# Altium schematic sheet POWER.SchDoc
size A3; SheetNumber: 5; SheetTotal: 13
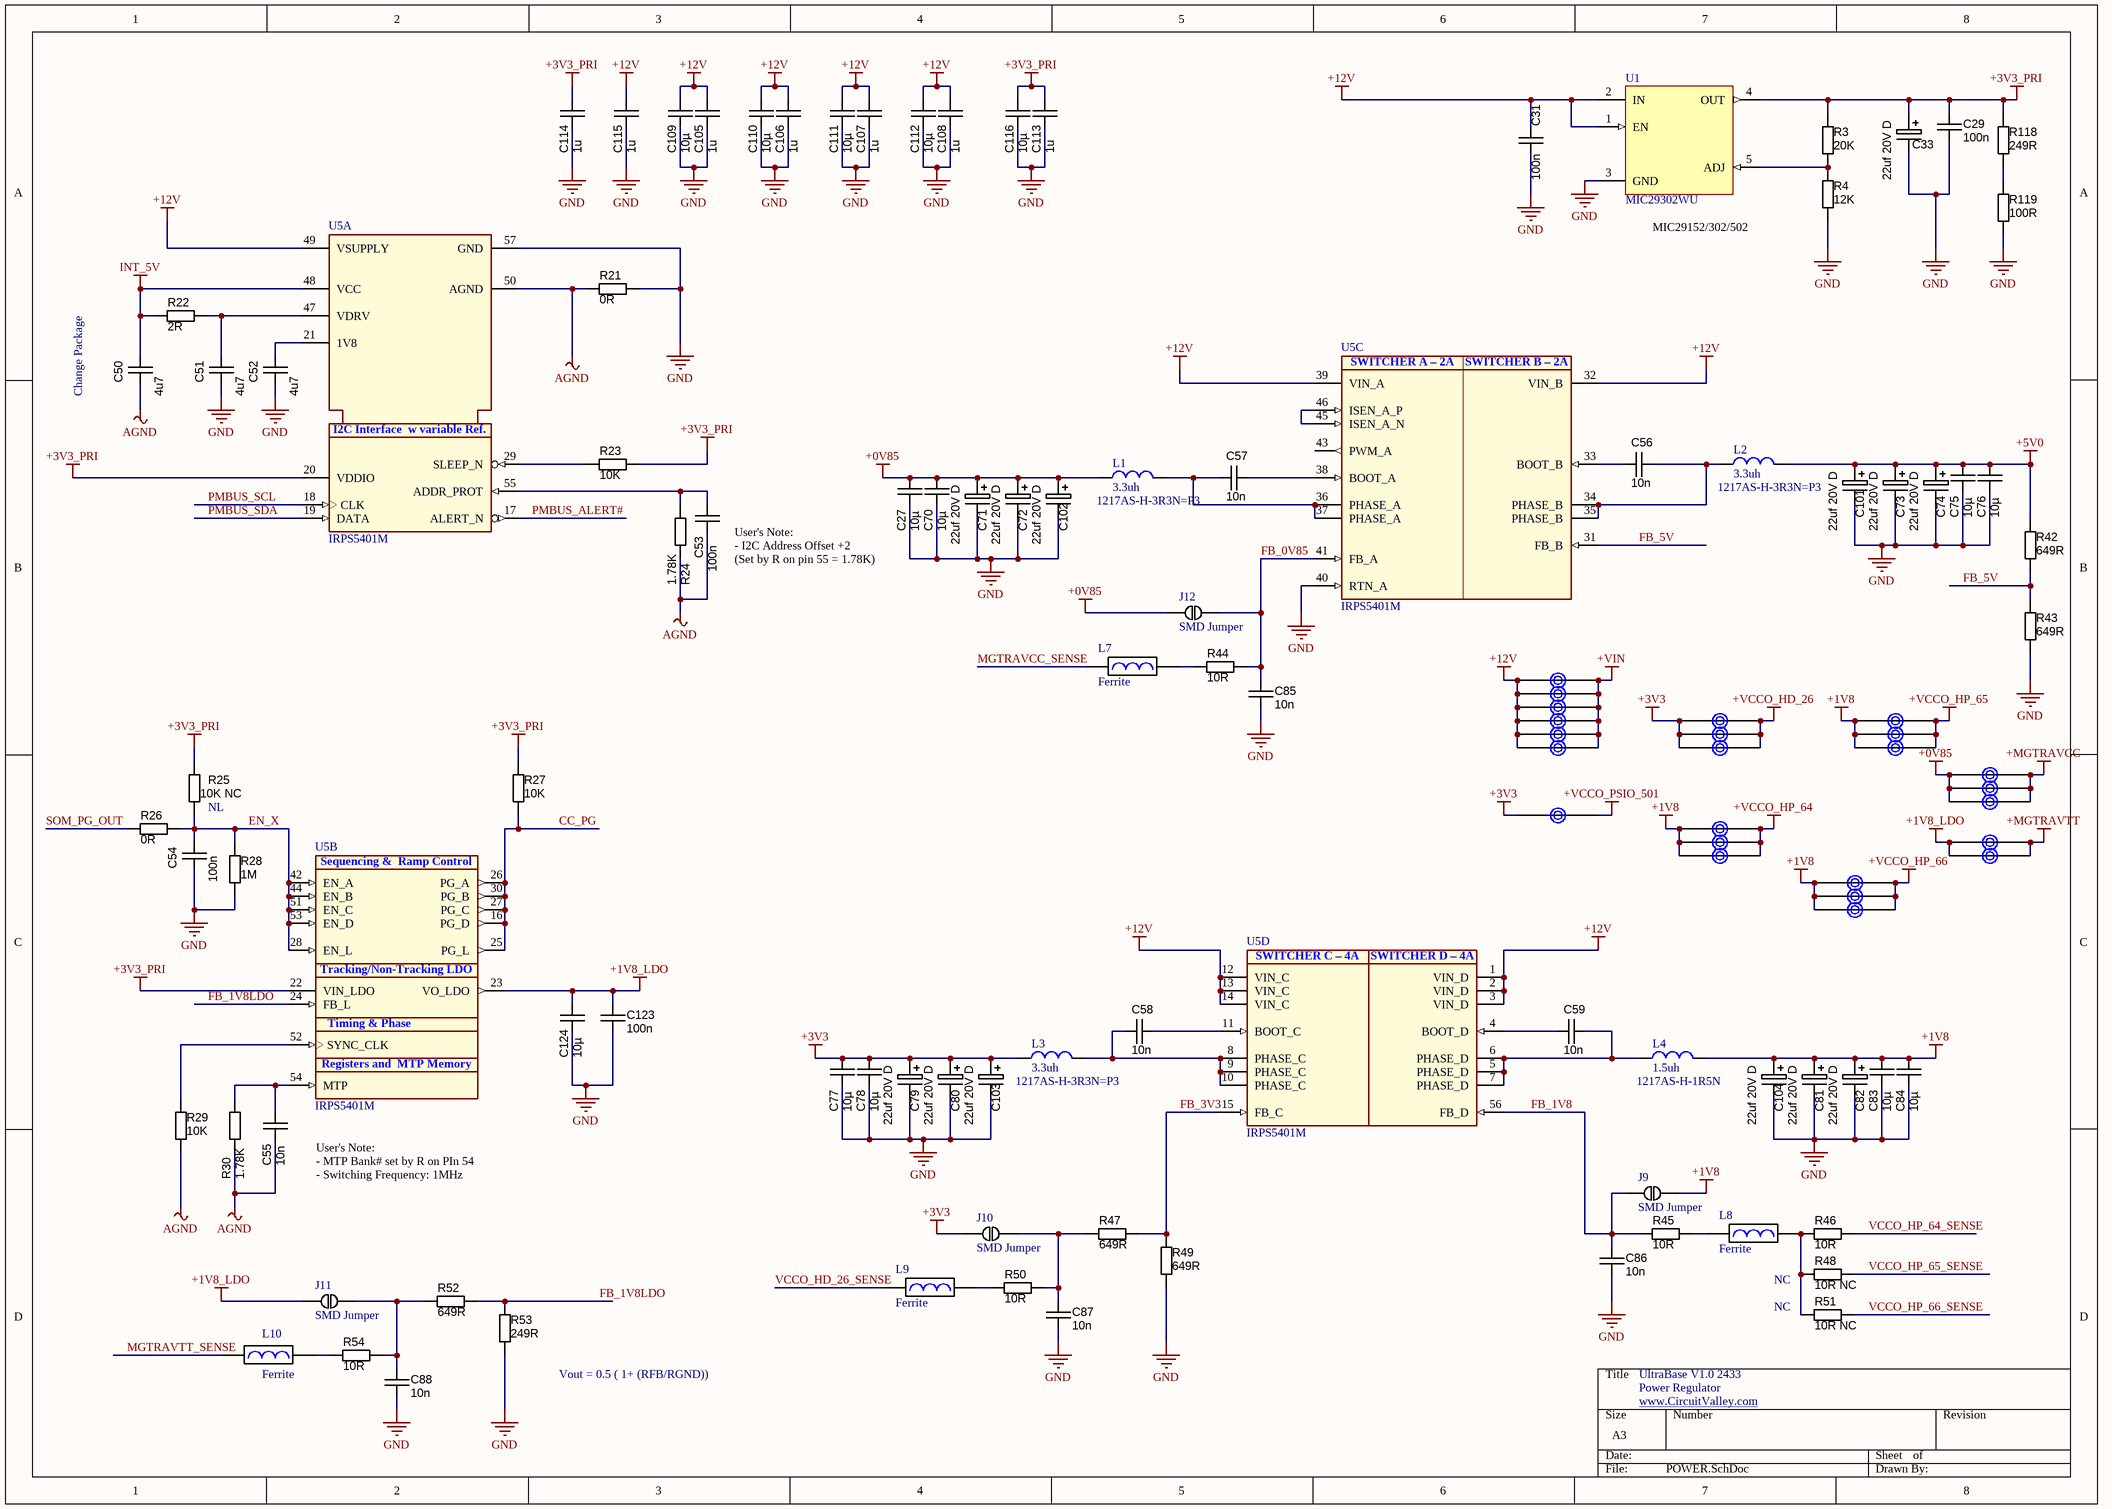
[diagram p0: POWER.SchDoc]

## Parts
C27  10µ  [CAPC3225N]
C29  100n  [CAPC1608N]
C31  100n  [CAPC1608N]
C33  value 22uf 20V D  [CAPMP7343X310N]  (hidden comment: 47uf 20V D)
C50  4u7  [CAPC1608N]
C51  4u7  [CAPC1608N]
C52  4u7  [CAPC1608N]
C53  100n  [CAPC1608N]
C54  100n  [CAPC1608N]
C55  10n  [CAPC1608N]
C56  10n  [CAPC1608N]
C57  10n  [CAPC1608N]
C58  10n  [CAPC1608N]
C59  10n  [CAPC1608N]
C70  10µ  [CAPC3225N]
C71  value 22uf 20V D  [CAPMP7343X310N]  (hidden comment: 47uf 20V D)
C72  value 22uf 20V D  [CAPMP7343X310N]  (hidden comment: 47uf 20V D)
C73  value 22uf 20V D  [CAPMP7343X310N]  (hidden comment: 47uf 20V D)
C74  value 22uf 20V D  [CAPMP7343X310N]  (hidden comment: 47uf 20V D)
C75  10µ  [CAPC3225N]
C76  10µ  [CAPC3225N]
C77  10µ  [CAPC3225N]
C78  10µ  [CAPC3225N]
C79  value 22uf 20V D  [CAPMP7343X310N]  (hidden comment: 47uf 20V D)
C80  value 22uf 20V D  [CAPMP7343X310N]  (hidden comment: 47uf 20V D)
C81  value 22uf 20V D  [CAPMP7343X310N]  (hidden comment: 47uf 20V D)
C82  value 22uf 20V D  [CAPMP7343X310N]  (hidden comment: 47uf 20V D)
C83  10µ  [CAPC3225N]
C84  10µ  [CAPC3225N]
C85  10n  [CAPC1608N]
C86  10n  [CAPC1608N]
C87  10n  [CAPC1608N]
C88  10n  [CAPC1608N]
C101  value 22uf 20V D  [CAPMP7343X310N]  (hidden comment: 47uf 20V D)
C102  value 22uf 20V D  [CAPMP7343X310N]  (hidden comment: 47uf 20V D)
C103  value 22uf 20V D  [CAPMP7343X310N]  (hidden comment: 47uf 20V D)
C104  value 22uf 20V D  [CAPMP7343X310N]  (hidden comment: 47uf 20V D)
C105  1u  [CAPC1608N]
C106  1u  [CAPC1608N]
C107  1u  [CAPC1608N]
C108  1u  [CAPC1608N]
C109  10µ  [CAPC3225N]
C110  10µ  [CAPC3225N]
C111  10µ  [CAPC3225N]
C112  10µ  [CAPC3225N]
C113  1u  [CAPC1608N]
C114  1u  [CAPC1608N]
C115  1u  [CAPC1608N]
C116  10µ  [CAPC3225N]
C123  100n  [CAPC1608N]
C124  10µ  [CAPC3225N]
J9  SMD Jumper  [SMD_Jumper]  (net tie, no BOM)
J10  SMD Jumper  [SMD_Jumper]  (net tie, no BOM)
J11  SMD Jumper  [SMD_Jumper]  (net tie, no BOM)
J12  SMD Jumper  [SMD_Jumper]  (net tie, no BOM)
L1  3.3uh  [1217AS-H-3R3N=P3]
L2  3.3uh  [1217AS-H-3R3N=P3]
L3  3.3uh  [1217AS-H-3R3N=P3]
L4  1.5uh  Part: 1217AS-H-1R5N  [1217AS-H-3R3N=P3]
L7  Ferrite  [FBC2012N]
L8  Ferrite  [FBC2012N]
L9  Ferrite  [FBC2012N]
L10  Ferrite  [FBC2012N]
R3  value 20K  [RESC1608N]  (hidden comment: RES_NL_0603)
R4  value 12K  [RESC1608N]  (hidden comment: RES_NL_0603)
R21  value 0R  [RESC1608N]  (hidden comment: RES_NL_0603)
R22  value 2R  [RESC1608N]  (hidden comment: RES_NL_0603)
R23  value 10K  [RESC1608N]  (hidden comment: RES_NL_0603)
R24  value 1.78K  [RESC1608N]  (hidden comment: RES_NL_0603)
R25  value 10K NC  [RESC1608N]  (hidden comment: RES_NL_0603)
R26  value 0R  [RESC1608N]  (hidden comment: RES_NL_0603)
R27  value 10K  [RESC1608N]  (hidden comment: RES_NL_0603)
R28  value 1M  [RESC1608N]  (hidden comment: RES_NL_0603)
R29  value 10K  [RESC1608N]  (hidden comment: RES_NL_0603)
R30  value 1.78K  [RESC1608N]  (hidden comment: RES_NL_0603)
R42  value 649R  [RESC1608N]  (hidden comment: RES_NL_0603)
R43  value 649R  [RESC1608N]  (hidden comment: RES_NL_0603)
R44  value 10R  [RESC1608N]  (hidden comment: RES_NL_0603)
R45  value 10R  [RESC1608N]  (hidden comment: RES_NL_0603)
R46  value 10R  [RESC1608N]  (hidden comment: RES_NL_0603)
R47  value 649R  [RESC1608N]  (hidden comment: RES_NL_0603)
R48  value 10R NC  [RESC1608N]  (hidden comment: RES_NL_0603)
R49  value 649R  [RESC1608N]  (hidden comment: RES_NL_0603)
R50  value 10R  [RESC1608N]  (hidden comment: RES_NL_0603)
R51  value 10R NC  [RESC1608N]  (hidden comment: RES_NL_0603)
R52  value 649R  [RESC1608N]  (hidden comment: RES_NL_0603)
R53  value 249R  [RESC1608N]  (hidden comment: RES_NL_0603)
R54  value 10R  [RESC1608N]  (hidden comment: RES_NL_0603)
R118  value 249R  [RESC1608N]  (hidden comment: RES_NL_0603)
R119  value 100R  [RESC1608N]  (hidden comment: RES_NL_0603)
T1  net_tie  [net_tie_0mm5]  (value not drawn)  (net tie, no BOM)
T2  net_tie  [net_tie_0mm5]  (value not drawn)  (net tie, no BOM)
T3  net_tie  [net_tie_0mm5]  (value not drawn)  (net tie, no BOM)
T4  net_tie  [net_tie_0mm5]  (value not drawn)  (net tie, no BOM)
T5  net_tie  [net_tie_0mm5]  (value not drawn)  (net tie, no BOM)
T6  net_tie  [net_tie_0mm5]  (value not drawn)  (net tie, no BOM)
T7  net_tie  [net_tie_0mm5]  (value not drawn)  (net tie, no BOM)
T8  net_tie  [net_tie_0mm5]  (value not drawn)  (net tie, no BOM)
T9  net_tie  [net_tie_0mm5]  (value not drawn)  (net tie, no BOM)
T10  net_tie  [net_tie_0mm5]  (value not drawn)  (net tie, no BOM)
T11  net_tie  [net_tie_0mm5]  (value not drawn)  (net tie, no BOM)
T12  net_tie  [net_tie_0mm5]  (value not drawn)  (net tie, no BOM)
T13  net_tie  [net_tie_0mm5]  (value not drawn)  (net tie, no BOM)
T14  net_tie  [net_tie_0mm5]  (value not drawn)  (net tie, no BOM)
T15  net_tie  [net_tie_0mm5]  (value not drawn)  (net tie, no BOM)
T16  net_tie  [net_tie_0mm5]  (value not drawn)  (net tie, no BOM)
T17  net_tie  [net_tie_0mm5]  (value not drawn)  (net tie, no BOM)
T18  net_tie  [net_tie_0mm5]  (value not drawn)  (net tie, no BOM)
T19  net_tie  [net_tie_0mm5]  (value not drawn)  (net tie, no BOM)
T20  net_tie  [net_tie_0mm5]  (value not drawn)  (net tie, no BOM)
T21  net_tie  [net_tie_0mm5]  (value not drawn)  (net tie, no BOM)
T22  net_tie  [net_tie_0mm5]  (value not drawn)  (net tie, no BOM)
T23  net_tie  [net_tie_0mm5]  (value not drawn)  (net tie, no BOM)
T24  net_tie  [net_tie_0mm5]  (value not drawn)  (net tie, no BOM)
U1  MIC29302WU  [TO-263-5]
U5  IRPS5401M  [INF-PG-QFN-56-7X7]  (parts A,B,C,D of 4)

## Nets
+0V85: C27.1 C70.1 C71.1 C72.1 C102.1 J12.1 L1.1 T8.1(PAD) T9.1(PAD) T10.1(PAD)
+1V8: C81.1 C82.1 C83.1 C84.1 C104.1 J9.2 L4.2 T3.1(PAD) T5.1(PAD) T7.1(PAD) T12.1(PAD) T13.1(PAD) T15.1(PAD) T17.1(PAD) T18.1(PAD) T19.1(PAD)
+1V8_LDO: C123.2 C124.1 J11.1 T14.1(PAD) T16.1(PAD) U5.23(VO_LDO)
+3V3: C77.1 C78.1 C79.1 C80.1 C103.1 J10.1 L3.1 T2.1(PAD) T4.1(PAD) T6.1(PAD) T11.1(PAD)
+3V3_PRI: C29.1 C33.1 C113.2 C114.2 C116.1 R3.1 R23.1 R25.2 R27.2 R118.1 U1.4(OUT) U5.20(VDDIO) U5.22(VIN_LDO)
+5V0: C73.1 C74.1 C75.1 C76.1 C101.1 L2.2 R42.1
+12V: C31.1 C105.2 C106.2 C107.2 C108.2 C109.1 C110.1 C111.1 C112.1 C115.2 T1.1(PAD) T20.1(PAD) T21.1(PAD) T22.1(PAD) T23.1(PAD) T24.1(PAD) U1.1(EN) U1.2(IN) U5.1(VIN_D) U5.2(VIN_D) U5.3(VIN_D) U5.12(VIN_C) U5.13(VIN_C) U5.14(VIN_C) U5.32(VIN_B) U5.39(VIN_A) U5.49(VSUPPLY)
+MGTRAVCC: T8.2(PAD) T9.2(PAD) T10.2(PAD)
+MGTRAVTT: T14.2(PAD) T16.2(PAD)
+VCCO_HD_26: T2.2(PAD) T4.2(PAD) T6.2(PAD)
+VCCO_HP_64: T12.2(PAD) T13.2(PAD) T15.2(PAD)
+VCCO_HP_65: T3.2(PAD) T5.2(PAD) T7.2(PAD)
+VCCO_HP_66: T17.2(PAD) T18.2(PAD) T19.2(PAD)
+VCCO_PSIO_501: T11.2(PAD)
+VIN: T1.2(PAD) T20.2(PAD) T21.2(PAD) T22.2(PAD) T23.2(PAD) T24.2(PAD)
AGND: C50.2 C53.2 C55.2 R21.1 R24.1 R29.2 R30.2 U5.50(AGND)
GND: C27.2 C29.2 C31.2 C33.2 C51.2 C52.2 C54.2 C70.2 C71.2 C72.2 C73.2 C74.2 C75.2 C76.2 C77.2 C78.2 C79.2 C80.2 C81.2 C82.2 C83.2 C84.2 C85.1 C86.1 C87.1 C88.1 C101.2 C102.2 C103.2 C104.2 C105.1 C106.1 C107.1 C108.1 C109.2 C110.2 C111.2 C112.2 C113.1 C114.1 C115.1 C116.2 C123.1 C124.2 R4.2 R21.2 R28.2 R43.2 R49.1 R53.1 R119.2 U1.3(GND) U5.40(RTN_A) U5.57(GND)
INT_5V: C50.1 R22.1 U5.48(VCC)
CC_PG: R27.1 U5.16(PG_D) U5.25(PG_L) U5.26(PG_A) U5.27(PG_C) U5.30(PG_B)
EN_X: C54.1 R25.1 R26.1 R28.1 U5.28(EN_L) U5.42(EN_A) U5.44(EN_B) U5.51(EN_C) U5.53(EN_D)
FB_0V85: C85.2 J12.2 R44.2 U5.41(FB_A)
FB_1V8: C86.2 J9.1 R45.1 U5.56(FB_D)
FB_1V8LDO: R52.2 R53.2 U5.24(FB_L)
FB_3V3: R47.2 R49.2 U5.15(FB_C)
FB_5V: R42.2 R43.1 U5.31(FB_B)
MGTRAVCC_SENSE: L7.1
MGTRAVTT_SENSE: L10.1
PMBUS_ALERT#: U5.17(ALERT_N)
PMBUS_SCL: U5.18(CLK)
PMBUS_SDA: U5.19(DATA)
SOM_PG_OUT: R26.2
VCCO_HD_26_SENSE: L9.1
VCCO_HP_64_SENSE: R46.2
VCCO_HP_65_SENSE: R48.2
VCCO_HP_66_SENSE: R51.2
NetC51_1: C51.1 R22.2 U5.47(VDRV)
NetC52_1: C52.1 U5.21(1V8)
NetC53_1: C53.1 R24.2 U5.55(ADDR_PROT)
NetC55_1: C55.1 R30.1 U5.54(MTP)
NetC56_1: C56.1 U5.33(BOOT_B)
NetC56_2: C56.2 L2.1 U5.34(PHASE_B) U5.35(PHASE_B)
NetC57_1: C57.1 L1.2 U5.36(PHASE_A) U5.37(PHASE_A)
NetC57_2: C57.2 U5.38(BOOT_A)
NetC58_1: C58.1 L3.2 U5.8(PHASE_C) U5.9(PHASE_C) U5.10(PHASE_C)
NetC58_2: C58.2 U5.11(BOOT_C)
NetC59_1: C59.1 U5.4(BOOT_D)
NetC59_2: C59.2 L4.1 U5.5(PHASE_D) U5.6(PHASE_D) U5.7(PHASE_D)
NetC87_2: C87.2 J10.2 R47.1 R50.2
NetC88_2: C88.2 J11.2 R52.1 R54.2
NetL7_2: L7.2 R44.1
NetL8_1: L8.1 R45.2
NetL8_2: L8.2 R46.1 R48.1 R51.1
NetL9_2: L9.2 R50.1
NetL10_2: L10.2 R54.1
NetR3_2: R3.2 R4.1 U1.5(ADJ)
NetR23_2: R23.2 U5.29(SLEEP_N)
NetR29_1: R29.1 U5.52(SYNC_CLK)
NetR118_2: R118.2 R119.1
NetU5_45: U5.45(ISEN_A_N) U5.46(ISEN_A_P)

Not connected (* = marked no-connect by the designer): U5 43(PWM_A)

## Notes on the sheet
- (near U1) MIC29152/302/502
- Change Package
- User's Note:
  - I2C Address Offset +2
  (Set by R on pin 55 = 1.78K)
- (near R25) NL
- User's Note:
  - MTP Bank# set by R on PIn 54
  - Switching Frequency: 1MHz
- NC
- Vout = 0.5 ( 1+ (RFB/RGND))
- UltraBase V1.0 2433
- Power Regulator
- www.CircuitValley.com <http://www.CircuitValley.com>
- (in symbol IRPS5401M, part A) I2C Interface  w variable Ref.
- (in symbol IRPS5401M, part B) Sequencing &  Ramp Control; Tracking/Non-Tracking LDO; Timing & Phase; Registers and  MTP Memory
- (in symbol IRPS5401M, part C) SWITCHER A – 2A; SWITCHER B – 2A
- (in symbol IRPS5401M, part D) SWITCHER C – 4A; SWITCHER D – 4A

## Library data of the parts
C27 C70 C75-C78 C83 C84 C109-C112 C116 C124 = CAPC_10u_1210_50V: Capacitor SMD Cer 10uF 20% 16V X5R 1210; Manufacturer 1: Taiyo Yuden; Manufacturer Part Number 1: UMK325BJ106MM-T; Ratings: 50V; X5R; Material: ceramic; Package / Case: 1210 (3225 Metric); Tolerance: ±20%; Size / Dimension: 0.126" L x 0.098" W (3.20mm x 2.50mm); Supplier 1: Digi-Key; Supplier Part Number 1: 587-2225-1-ND; Value: 10µ
C29 C31 = CAPC_1n_0603_100V: Capacitor SMD Cer 1nF 10% 100V X7R 0603; Manufacturer 1: Murata Electronics North America; Manufacturer Part Number 1: GCM188R72A102KA37D; Ratings: 100V; X7R; Material: ceramic; Package / Case: 0603 (1608 metric); Tolerance: ±10%; Supplier 1: Digi-Key; Supplier Part Number 1: 490-4780-1-ND; Operating Temperature: -55°C ~ 125°C; Size / Dimension: 0.063" L x 0.031" W (1.60mm x 0.80mm); Thickness (Max): 0.035" (0.90mm); ComponentLink1URL: http://search.murata.co.jp/Ceramy/image/img/PDF/ENG/GCM188R72A102KA37.pdf; ComponentLink1Description: http://search.murata.co.jp/Ceramy/image/img/PDF/ENG/GCM188R72A102KA37.pdf; Value: 100n
C33 = CAPT_330u_2917_6V3: Capacitor SMD Tant 330uF 20% 6V3 2917; Manufacturer Part Number: T520D337M006ATE015; Part: TAJD336K020R; Ratings: 6.3V; Material: Solid Tantalum; ESR (Equivalent Series Resistance): 15 mOhm; Package / Case: 2917 (7343 Metric); Tolerance: ±20%; Operating Temperature: -55°C ~ 125°C; Size / Dimension: 0.287" L x 0.169" W (7.30mm x 4.30mm); Height - Seated (Max): 0.122" (3.10mm); Manufacturer Size Code: D; Supplier 1: Digi-Key; Supplier Part Number 1: 399-4052-1-ND; ComponentLink1URL: http://www.kemet.com/datasheets&T520D337M006ATE015; ComponentLink1Description: T520D Datasheet
C50-C59 C85-C88 C105-C108 C113-C115 C123 = CAPC_120p_0603_C0G_50V: Capacitor SMD Cer 120pF 10% 50V C0G 0603; Manufacturer 1: Kemet; Manufacturer Part Number 1: C0603C121K5GACTU; Ratings: 50V; C0G; Tolerance: ±10%; Operating Temperature: -55°C ~ 125°C; Package / Case: 0603 (1608 Metric); Supplier 1: Mouser; Supplier Part Number 1: 80-C0603C121K5G
  C50-C52: Value: 4u7
  C53 C54 C123: Value: 100n
  C55-C59 C85-C88: Value: 10n
  C105-C108 C113-C115: Value: 1u
C71-C74 C79-C82 C101-C104 = CAPT_330u_2917_6V3: Capacitor SMD Tant 330uF 20% 6V3 2917; Manufacturer Part Number: T520D337M006ATE015; Part: TCJY226M025R0070; Ratings: 6.3V; Material: Solid Tantalum; ESR (Equivalent Series Resistance): 15 mOhm; Package / Case: 2917 (7343 Metric); Tolerance: ±20%; Operating Temperature: -55°C ~ 125°C; Size / Dimension: 0.287" L x 0.169" W (7.30mm x 4.30mm); Height - Seated (Max): 0.122" (3.10mm); Manufacturer Size Code: D; Supplier 1: Digi-Key; Supplier Part Number 1: 399-4052-1-ND; ComponentLink1URL: http://www.kemet.com/datasheets&T520D337M006ATE015; ComponentLink1Description: T520D Datasheet
J9-J12 = SMD_Jumper
L1-L4 = inductor_smd
  L1-L3: Part: 1217AS-H-3R3N=P3
L7-L10 = Ferrite Bead
R3 R4 R21-R30 R42-R54 R118 R119 = RES_NL_0603: Resistor, SMD chip; Manufacturer 1: Royal Ohm; Ratings: 1/10 W; Tolerance: ±5%; Package / Case: 0603 (1608 metric)
U5 = IRPS5401M: PMIC Flexible Power Management Unit; Manufacturer: Infineon Technologies; PackageReference: QFN 7X7 56L; ManufacturerPartNumber: IRPS5401M